# EasyEDA schematic SCH_blaster_2025-10-02.json

## Sheets
1 Blaster Board: TITLE: Blaster Board; REV: 1.0; Date: 2020-08-12; Sheet: 1/1; Drawn By: SomebodiesDad; Company: Your Company
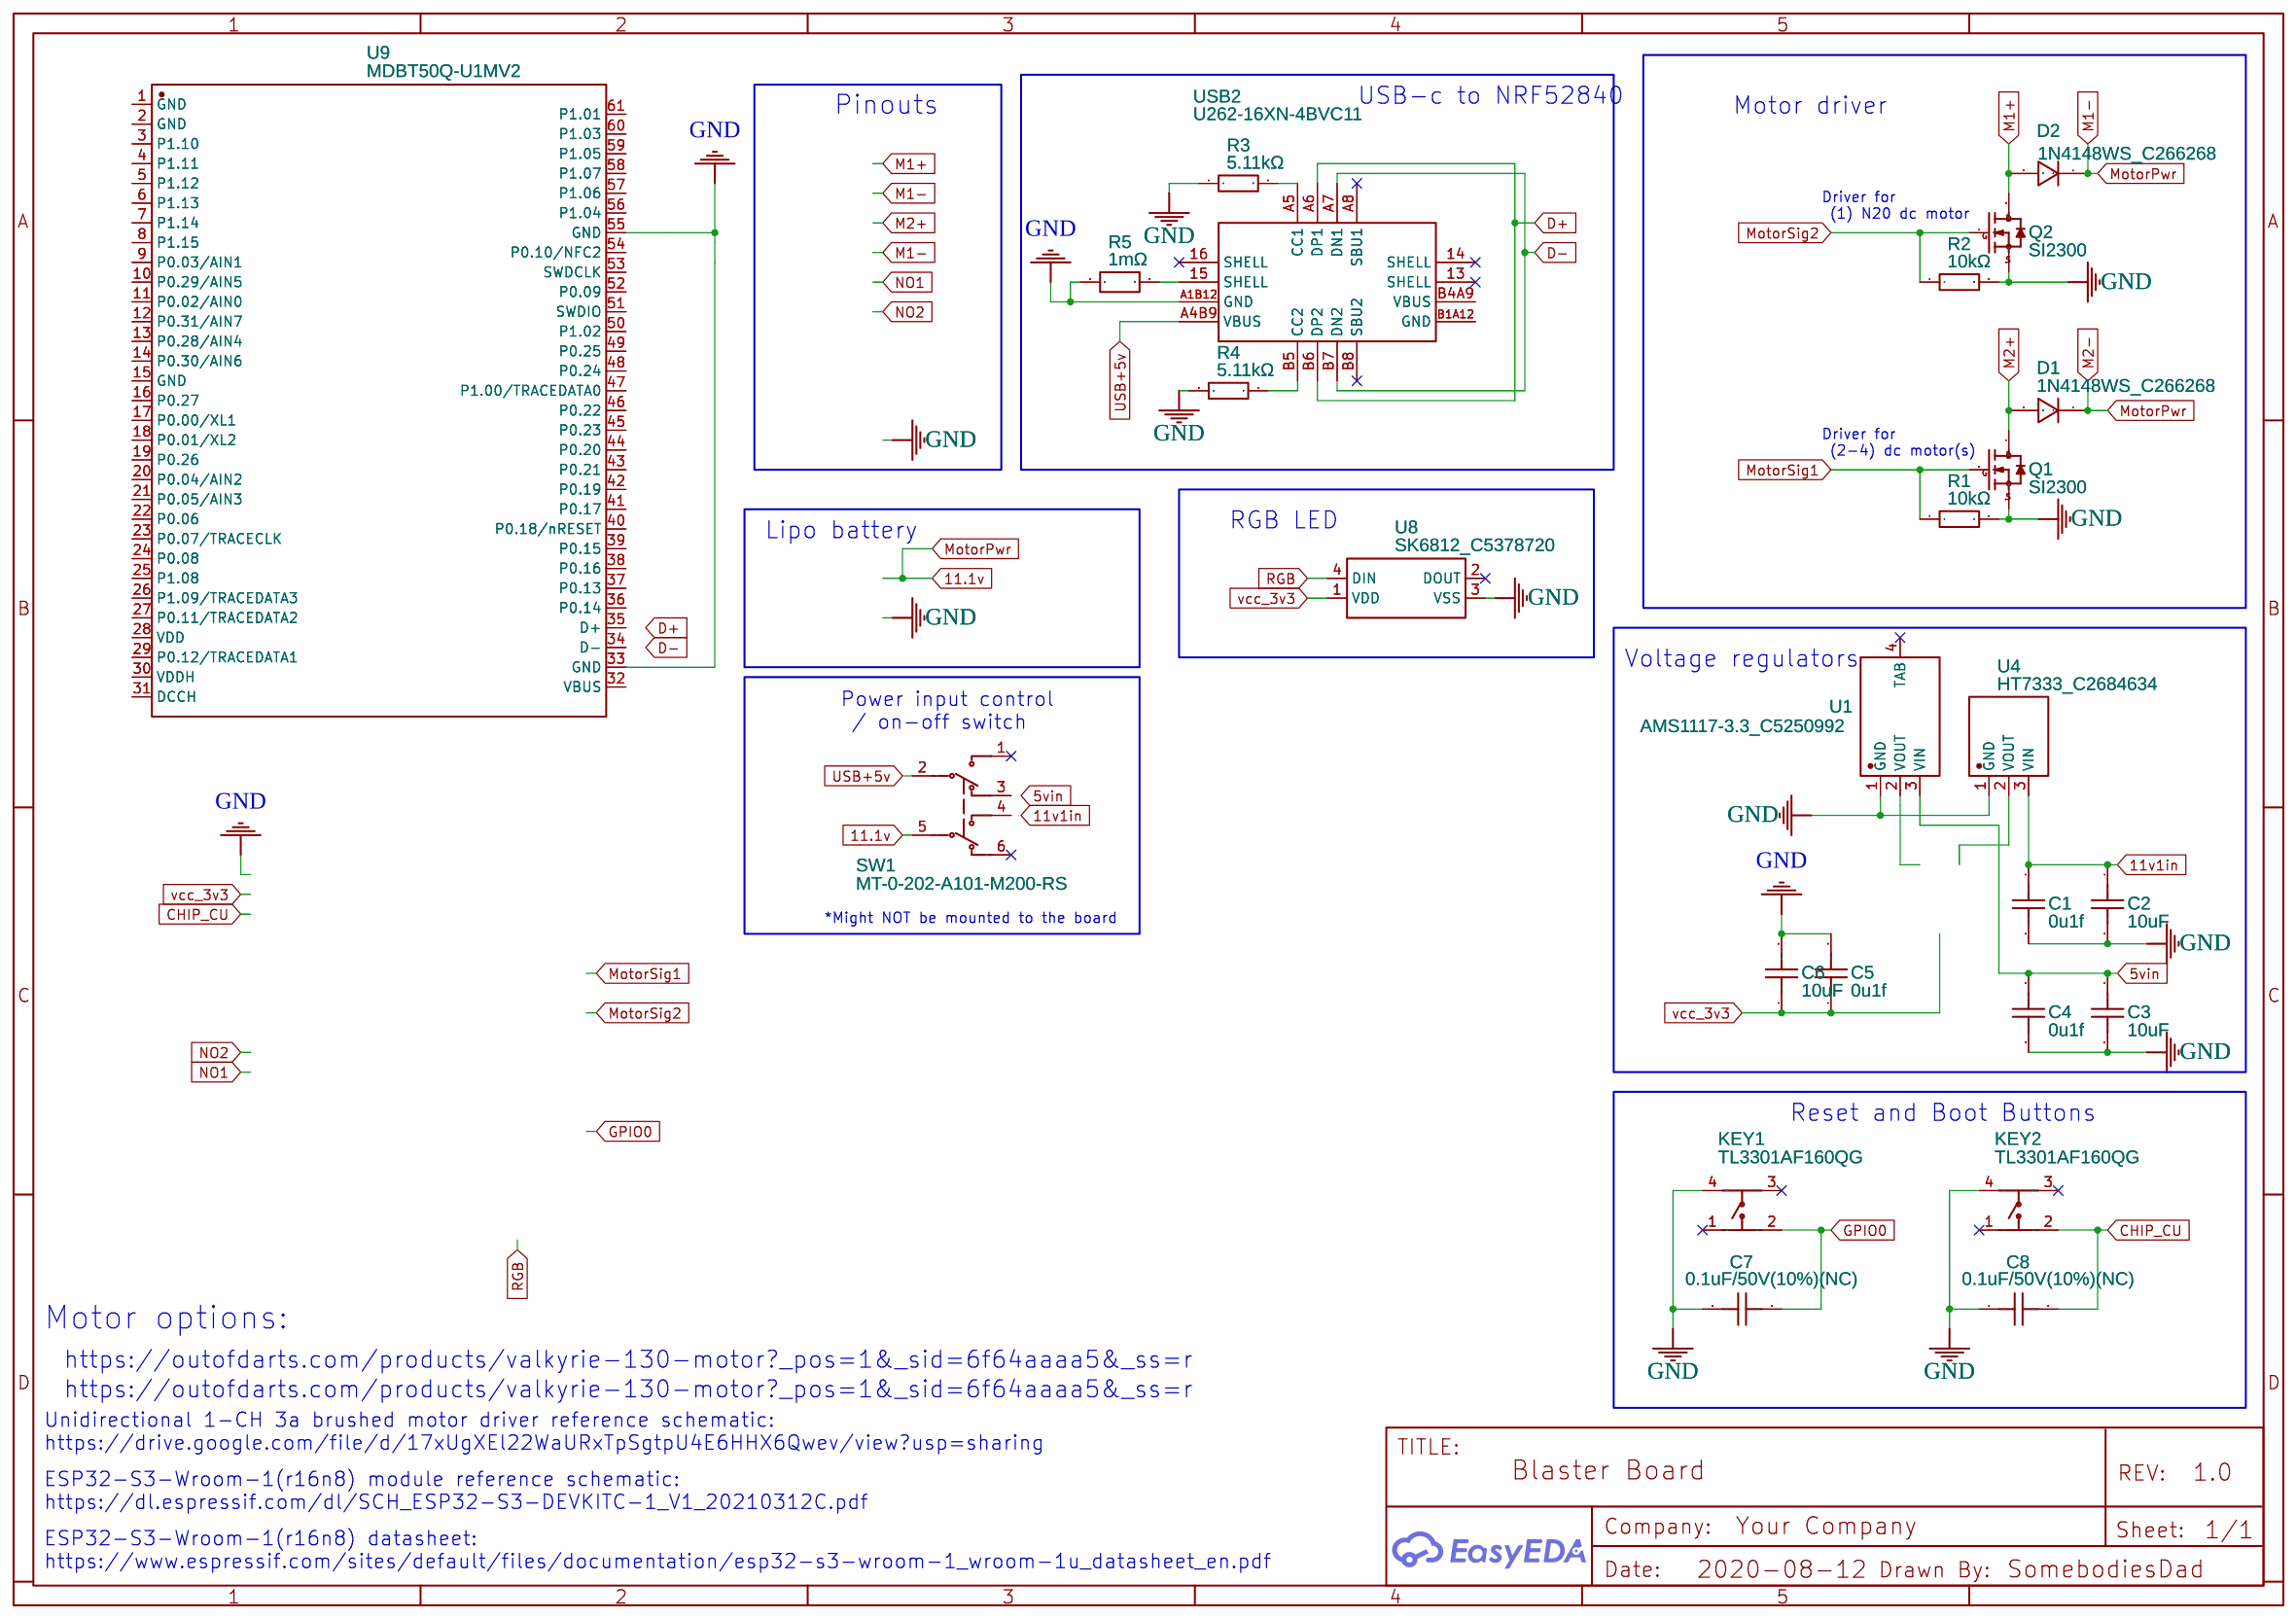
[diagram p0: Blaster Board]
2 Materials: TITLE: Sheet_1; Date: 2025-06-04; Drawn By: donovan jackson
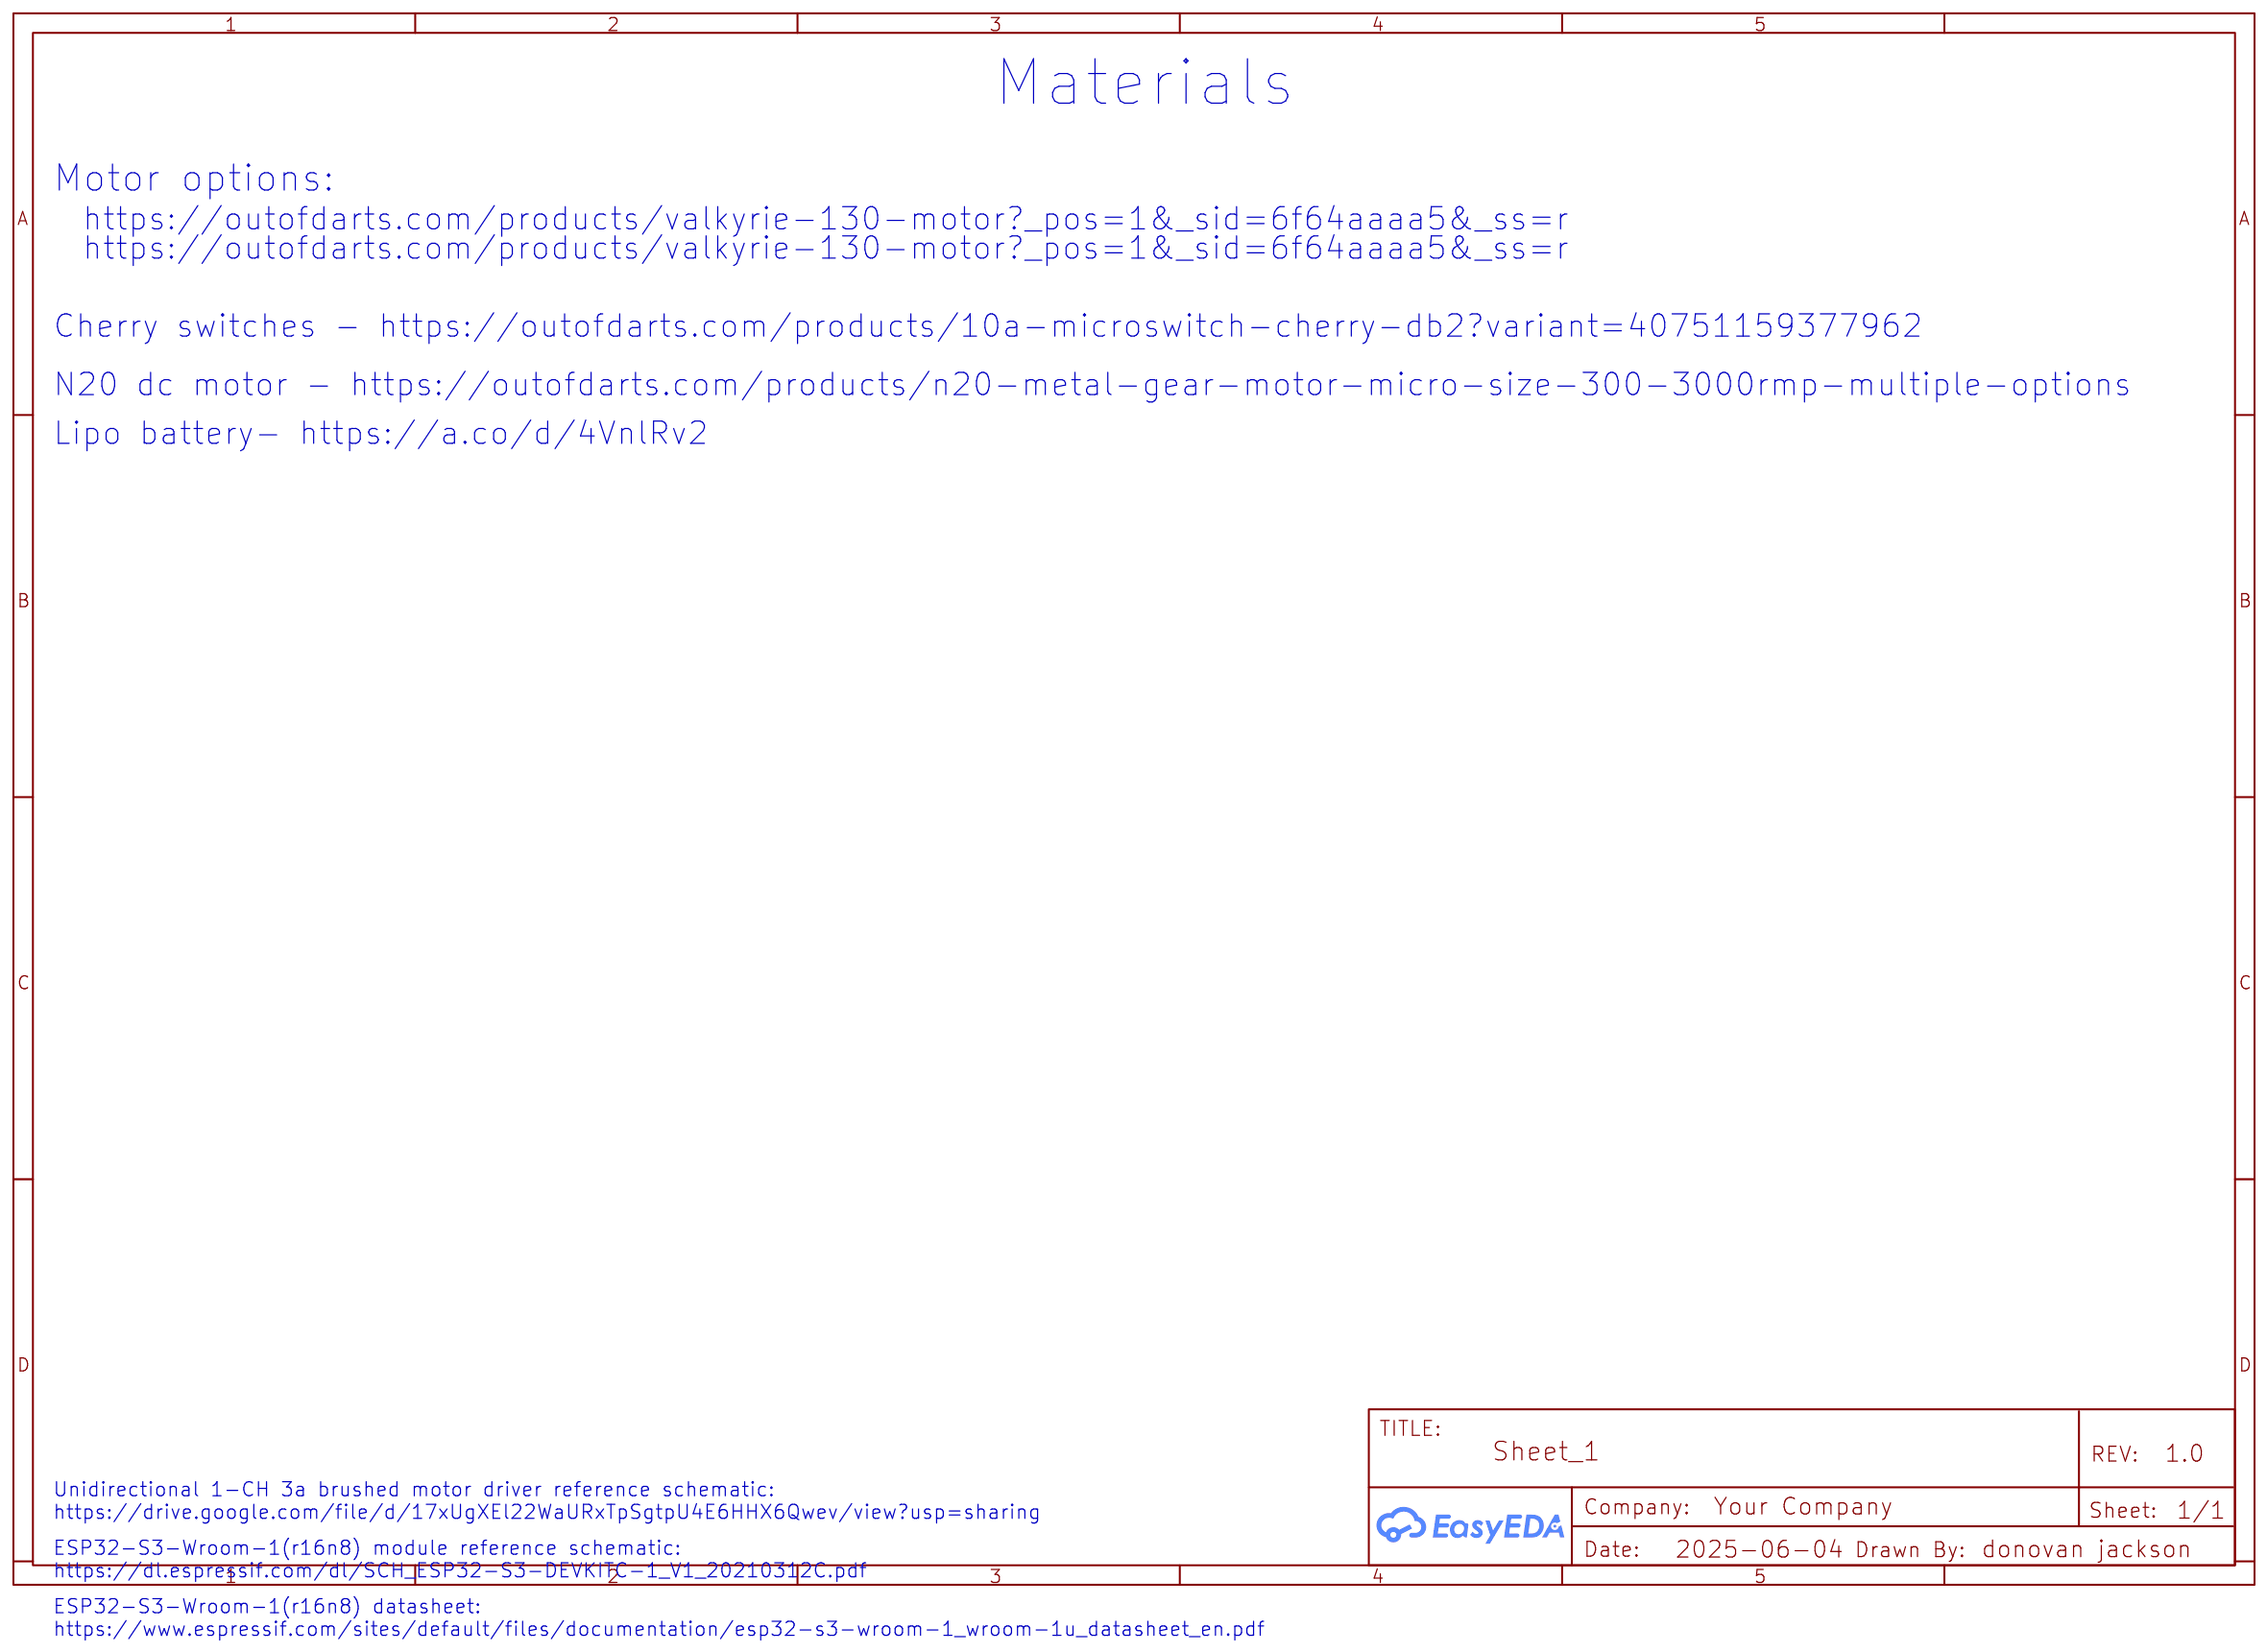
[diagram p1: Materials]

## Parts
C1  0u1f  [C0603]
C2  10uF  [C0603]
C3  10uF  [C0603]
C4  0u1f  [C0603]
C5  0u1f  [C0603]
C6  10uF  [C0603]
C7  0.1uF/50V(10%)(NC)  [C0603]
C8  0.1uF/50V(10%)(NC)  [C0603]
D1  1N4148WS_C266268  [SOD-323_L1.8-W1.3-LS2.5-RD]
D2  1N4148WS_C266268  [SOD-323_L1.8-W1.3-LS2.5-RD]
KEY1  TL3301AF160QG  [KEY-SMD_4P-L6.0-W6.0-P4.50-LS10.0]
KEY2  TL3301AF160QG  [KEY-SMD_4P-L6.0-W6.0-P4.50-LS10.0]
Q1  SI2300  [SOT-23-3_L2.9-W1.3-P1.90-LS2.4-BR]
Q2  SI2300  [SOT-23-3_L2.9-W1.3-P1.90-LS2.4-BR]
R1  10kΩ  [R0805]
R2  10kΩ  [R0805]
R3  5.11kΩ  [R0201]
R4  5.11kΩ  [R0201]
R5  1mΩ  [R0805]
SW1  MT-0-202-A101-M200-RS  [SW-TH_6P-P4.70_MT-0-202-A101-M200-RS-PJ]
U1  AMS1117-3.3_C5250992  [SOT-223-3_L6.5-W3.5-P3.05-LS7.0]
U4  HT7333_C2684634  [SOT-23-3_L2.9-W1.6-P1.90-LS2.8-BR]
U8  SK6812_C5378720  [LED-SMD_4P-L5.0-W5.0-LS5.4-TL-1]
U9  MDBT50Q-U1MV2  [COMM-SMD_MDBT50Q-U1MV2]
USB2  U262-16XN-4BVC11  [USB-3.1-SMD_U262-161N-4BVC11]

## Library data of the parts
C1-C8 = C_0603_US: Contributor: LCEDA_Lib
D1 D2 = 1N4148WS_C266268: Contributor: LCSC; Supplier: LCSC; Supplier Part: C266268; Manufacturer: GOOD-ARK(固锝); Manufacturer Part: 1N4148WS; JLCPCB Part Class: Extended Part
KEY1 KEY2 = TL3301AF160QG: Contributor: LCSC; Supplier: LCSC; Supplier Part: C273519; Manufacturer: E-Switch; JLCPCB Part Class: Extended Part
Q1 Q2 = SI2300: Contributor: LCSC; Supplier: LCSC; Manufacturer: Hottech(合科泰); Supplier Part: C181085; JLCPCB Part Class: Extended Part
R1 R2 = 0805W8F1002T5E: Supplier: LCSC; Manufacturer: UNI-ROYAL(厚声); Supplier Part: C17414; JLCPCB Part Class: Basic Part
R3 R4 = 0201WMF5111TEE: Contributor: LCSC; Supplier: LCSC; Supplier Part: C473521; Manufacturer: UNI-ROYAL(厚声)
R5 = WFC08051L000FE66: Contributor: lcsc; Supplier: LCSC; Supplier Part: C4337252; Manufacturer: VISHAY(威世); JLCPCB Part Class: Extended Part
SW1 = MT-0-202-A101-M200-RS: Supplier: LCSC; Supplier Part: C1788494; Manufacturer: YUEN FUNG(源丰); JLCPCB Part Class: Extended Part; Contributor: lcsc; link: https://lcsc.com/eda_search?q=C1788494&%26type=1&ref=editor
U1 = AMS1117-3.3_C5250992: Supplier: LCSC; Supplier Part: C5250992; Manufacturer: TWGMC(台湾迪嘉); Manufacturer Part: AMS1117-3.3; JLCPCB Part Class: Extended Part; Contributor: lcsc
U4 = HT7333_C2684634: Contributor: LCSC; Supplier: LCSC; Supplier Part: C2684634; Manufacturer: 国芯佳品; Manufacturer Part: HT7333; JLCPCB Part Class: Extended Part
U8 = SK6812_C5378720: Supplier: LCSC; Supplier Part: C5378720; Manufacturer: 欧思科光电; Manufacturer Part: SK6812; JLCPCB Part Class: Extended Part; Contributor: lcsc
U9 = MDBT50Q-U1MV2: Supplier: LCSC; Supplier Part: C2688382; Manufacturer: RAYTAC; JLCPCB Part Class: Extended Part; Contributor: lcsc
USB2 = U262-16XN-4BVC11: Contributor: LCSC; Supplier: LCSC; Supplier Part: C319148; Manufacturer: XKB Connection(中国星坤); Manufacturer Part: U262-161N-4BVC11; JLCPCB Part Class: Extended Part

## Nets
5vin: C3.1 C4.1 U1.3(VIN)
11.1v: D1.1 D2.1 SW1.5
11v1in: C1.1 C2.1 U4.3(VIN)
GND: C1.2 C2.2 C3.2 C4.2 C5.2 C6.2 C7.1 C8.1 KEY1.4 KEY2.4 Q1.2(S) Q2.2(S) R1.2 R2.2 R3.1 R4.1 R5.1 U1.1(GND) U4.1(GND) U8.3(VSS) U9.33(GND) U9.55(GND) USB2.A1B12(GND)
vcc_3v3: C5.1 C6.1 U8.1(VDD)
CHIP_CU: C8.2 KEY2.2
D+: USB2.A6(DP1) USB2.B6(DP2)
D-: USB2.A7(DN1) USB2.B7(DN2)
GPIO0: C7.2 KEY1.2
M1+: D2.2 Q2.3(D)
M2+: D1.2 Q1.3(D)
MotorSig1: Q1.1(G) R1.1
MotorSig2: Q2.1(G) R2.1
RGB: U8.4(DIN)
USB+5v: SW1.2 USB2.A4B9(VBUS)
Net-(R3-2): R3.2 USB2.A5(CC1)
Net-(R4-2): R4.2 USB2.B5(CC2)
Net-(R5-2): R5.2 USB2.15(SHELL)

Not connected (* = marked no-connect by the designer): KEY1 1* 3*; KEY2 1* 3*; SW1 1* 3 4 6*; U1 2(VOUT) 4(TAB)*; U4 2(VOUT); U8 2(DOUT)*; U9 1(GND) 2(GND) 3(P1.10) 4(P1.11) 5(P1.12) 6(P1.13) 7(P1.14) 8(P1.15) 9(P0.03/AIN1) 10(P0.29/AIN5) 11(P0.02/AIN0) 12(P0.31/AIN7) 13(P0.28/AIN4) 14(P0.30/AIN6) 15(GND) 16(P0.27) 17(P0.00/XL1) 18(P0.01/XL2) 19(P0.26) 20(P0.04/AIN2) 21(P0.05/AIN3) 22(P0.06) 23(P0.07/TRACECLK) 24(P0.08) 25(P1.08) 26(P1.09/TRACEDATA3) 27(P0.11/TRACEDATA2) 28(VDD) 29(P0.12/TRACEDATA1) 30(VDDH) 31(DCCH) 32(VBUS) 34(D-) 35(D+) 36(P0.14) 37(P0.13) 38(P0.16) 39(P0.15) 40(P0.18/nRESET) 41(P0.17) 42(P0.19) 43(P0.21) 44(P0.20) 45(P0.23) 46(P0.22) 47(P1.00/TRACEDATA0) 48(P0.24) 49(P0.25) 50(P1.02) 51(SWDIO) 52(P0.09) 53(SWDCLK) 54(P0.10/NFC2) 56(P1.04) 57(P1.06) 58(P1.07) 59(P1.05) 60(P1.03) 61(P1.01); USB2 13(SHELL)* 14(SHELL)* 16(SHELL)* A8(SBU1)* B1A12(GND) B4A9(VBUS) B8(SBU2)*

## Notes on the sheets
sheet 1
- Pinouts
- USB-c to NRF52840
- Motor driver
- Driver for
   (1) N20 dc motor
- Driver for
   (2-4) dc motor(s)
- RGB LED
- Lipo battery
- Voltage regulators
- Power input control
   / on-off switch
- *Might NOT be mounted to the board
- Reset and Boot Buttons
- Motor options:
- https://outofdarts.com/products/valkyrie-130-motor?_pos=1&_sid=6f64aaaa5&_ss=r
- https://outofdarts.com/products/valkyrie-130-motor?_pos=1&_sid=6f64aaaa5&_ss=r
- Unidirectional 1-CH 3a brushed motor driver reference schematic:
  https://drive.google.com/file/d/17xUgXEl22WaURxTpSgtpU4E6HHX6Qwev/view?usp=sharing
- ESP32-S3-Wroom-1(r16n8) module reference schematic:
  https://dl.espressif.com/dl/SCH_ESP32-S3-DEVKITC-1_V1_20210312C.pdf
- ESP32-S3-Wroom-1(r16n8) datasheet:
  https://www.espressif.com/sites/default/files/documentation/esp32-s3-wroom-1_wroom-1u_datasheet_en.pdf
sheet 2
- Materials
- Motor options:
- https://outofdarts.com/products/valkyrie-130-motor?_pos=1&_sid=6f64aaaa5&_ss=r
- https://outofdarts.com/products/valkyrie-130-motor?_pos=1&_sid=6f64aaaa5&_ss=r
- Cherry switches - https://outofdarts.com/products/10a-microswitch-cherry-db2?variant=40751159377962
- N20 dc motor - https://outofdarts.com/products/n20-metal-gear-motor-micro-size-300-3000rmp-multiple-options
- Lipo battery- https://a.co/d/4VnlRv2
- Unidirectional 1-CH 3a brushed motor driver reference schematic:
  https://drive.google.com/file/d/17xUgXEl22WaURxTpSgtpU4E6HHX6Qwev/view?usp=sharing
- ESP32-S3-Wroom-1(r16n8) module reference schematic:
  https://dl.espressif.com/dl/SCH_ESP32-S3-DEVKITC-1_V1_20210312C.pdf
- ESP32-S3-Wroom-1(r16n8) datasheet:
  https://www.espressif.com/sites/default/files/documentation/esp32-s3-wroom-1_wroom-1u_datasheet_en.pdf
